# Altium schematic sheet SpeakEasy_Microphone.SchDoc
size A
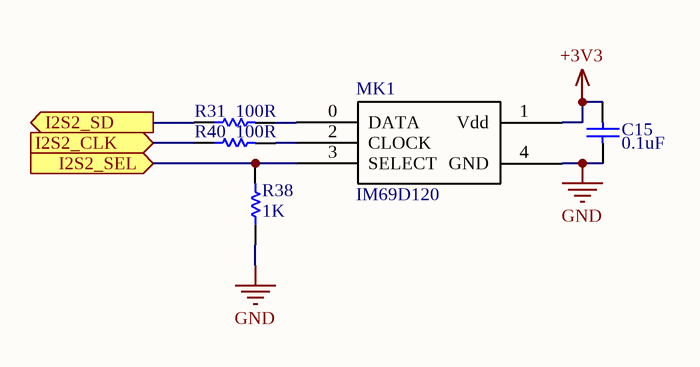
[diagram p0: SpeakEasy_Microphone.SchDoc]

## Parts
C15  0.1uF  [CAPC0805(2012)145_L]
MK1  IM69D120  [M69D120]
R31  100R  [RESC0805(2012)_L]
R38  1k  [RESC0805(2012)_L]
R40  100R  [RESC0805(2012)_L]

## Ports
I2S2_CLK (in), I2S2_SD (out), I2S2_SEL (in)

## Nets
+3V3: C15.2 MK1.1(Vdd)
GND: C15.1 MK1.4(GND) R38.1
I2S2_CLK: R40.1 ; port I2S2_CLK
I2S2_SD: R31.1 ; port I2S2_SD
I2S2_SEL: MK1.3(SELECT) R38.2 ; port I2S2_SEL
NetMK1_0: MK1.0(DATA) R31.2
NetMK1_2: MK1.2(CLOCK) R40.2

## Library data of the parts
C15 = CMP-1590-00003-1: 0805 (2012 Metric) Chip Capacitor; Case-EIA: 0805; Case-Metric: 2012; PackageReference: CAPC0805(2012)145; Value: 0.1uF
MK1 = IM69D120: High Performance MEMS microphone utilizing PDM; pin to pad: 0>1 1>2 2>3 3>4 4>5; ComponentLink1Description: Datasheet; ComponentLink1URL: https://www.infineon.com/dgdl/Infineon-IM69D120-DS-v01_00-EN.pdf?fileId=5546d462602a9dc801607a0e41a01a2b
R31 R38 R40 = CMP-1591-00002-1: 0805 (2012 Metric) Chip Resistor; Case-EIA: 0805; Case-Metric: 2012; PackageReference: RESC0805(2012)
  R31 R40: Value: 100R
  R38: Value: 1K